# Altium project TrailerController_SuspensionPMS.PrjPcb
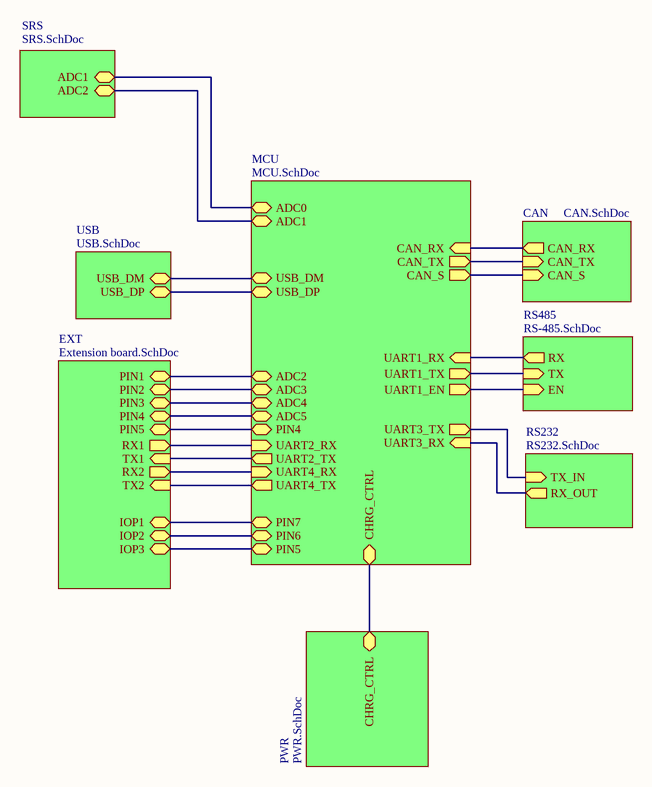
[diagram p0: Main.SchDoc]
9 sheets, 162 parts. Net scope: hierarchical (ports join the sheet entries above them; power ports are global).
Board file: PCB1.PcbDoc
Sheets:
  Main.SchDoc
    SRS = SRS.SchDoc
    MCU = MCU.SchDoc
    CAN = CAN.SchDoc
    PWR = PWR.SchDoc
    USB = USB.SchDoc
    RS485 = RS-485.SchDoc
    RS232 = RS232.SchDoc
    EXT = Extension board.SchDoc

## Sheet Main.SchDoc
size A4

### Sub-sheets
CAN = CAN.SchDoc: CAN_TX (in), CAN_RX (out), CAN_S (in)
EXT = Extension board.SchDoc: PIN1, PIN2, PIN3, PIN4, RX1 (out), TX1 (in), RX2 (out), TX2 (in), IOP1, IOP2, IOP3, PIN5
MCU = MCU.SchDoc: CAN_RX (in), CAN_TX (out), CAN_S (out), USB_DM (bidir), USB_DP (bidir), ADC0, ADC1, ADC2, ADC3, ADC4, ADC5, UART3_TX (out), UART3_RX (in), UART1_RX (in), UART1_TX (out), UART1_EN (out), UART2_RX (in), UART2_TX (out), UART4_RX (in), UART4_TX (out), PIN7, PIN6, CHRG_CTRL, PIN5, PIN4
PWR = PWR.SchDoc: CHRG_CTRL
RS232 = RS232.SchDoc: TX_IN (in), RX_OUT (out)
RS485 = RS-485.SchDoc: RX (out), TX (in), EN (in)
SRS = SRS.SchDoc: ADC1, ADC2
USB = USB.SchDoc: USB_DM (bidir), USB_DP (bidir)

### Nets
ADC0: sheet SRS/ADC1, sheet MCU/ADC0
ADC1: sheet SRS/ADC2, sheet MCU/ADC1
ADC2: sheet MCU/ADC2, sheet EXT/PIN1
ADC3: sheet MCU/ADC3, sheet EXT/PIN2
ADC4: sheet MCU/ADC4, sheet EXT/PIN3
ADC5: sheet MCU/ADC5, sheet EXT/PIN4
CAN_RX: sheet MCU/CAN_RX, sheet CAN/CAN_RX
CAN_S: sheet MCU/CAN_S, sheet CAN/CAN_S
CAN_TX: sheet MCU/CAN_TX, sheet CAN/CAN_TX
CHRG_CTRL: sheet MCU/CHRG_CTRL, sheet PWR/CHRG_CTRL
IOP4: sheet MCU/PIN4, sheet EXT/PIN5
IOP5: sheet MCU/PIN5, sheet EXT/IOP3
IOP6: sheet MCU/PIN6, sheet EXT/IOP2
IOP7: sheet MCU/PIN7, sheet EXT/IOP1
RX: sheet MCU/UART1_RX, sheet RS485/RX
RX1: sheet MCU/UART3_RX, sheet RS232/RX_OUT
TX: sheet MCU/UART1_TX, sheet RS485/TX
TX1: sheet MCU/UART3_TX, sheet RS232/TX_IN
UART1_EN: sheet MCU/UART1_EN, sheet RS485/EN
UART2_RX: sheet MCU/UART2_RX, sheet EXT/RX1
UART2_TX: sheet MCU/UART2_TX, sheet EXT/TX1
UART4_RX: sheet MCU/UART4_RX, sheet EXT/RX2
UART4_TX: sheet MCU/UART4_TX, sheet EXT/TX2
USB_DM: sheet MCU/USB_DM, sheet USB/USB_DM
USB_DP: sheet MCU/USB_DP, sheet USB/USB_DP

## Sheet SRS.SchDoc
size A4
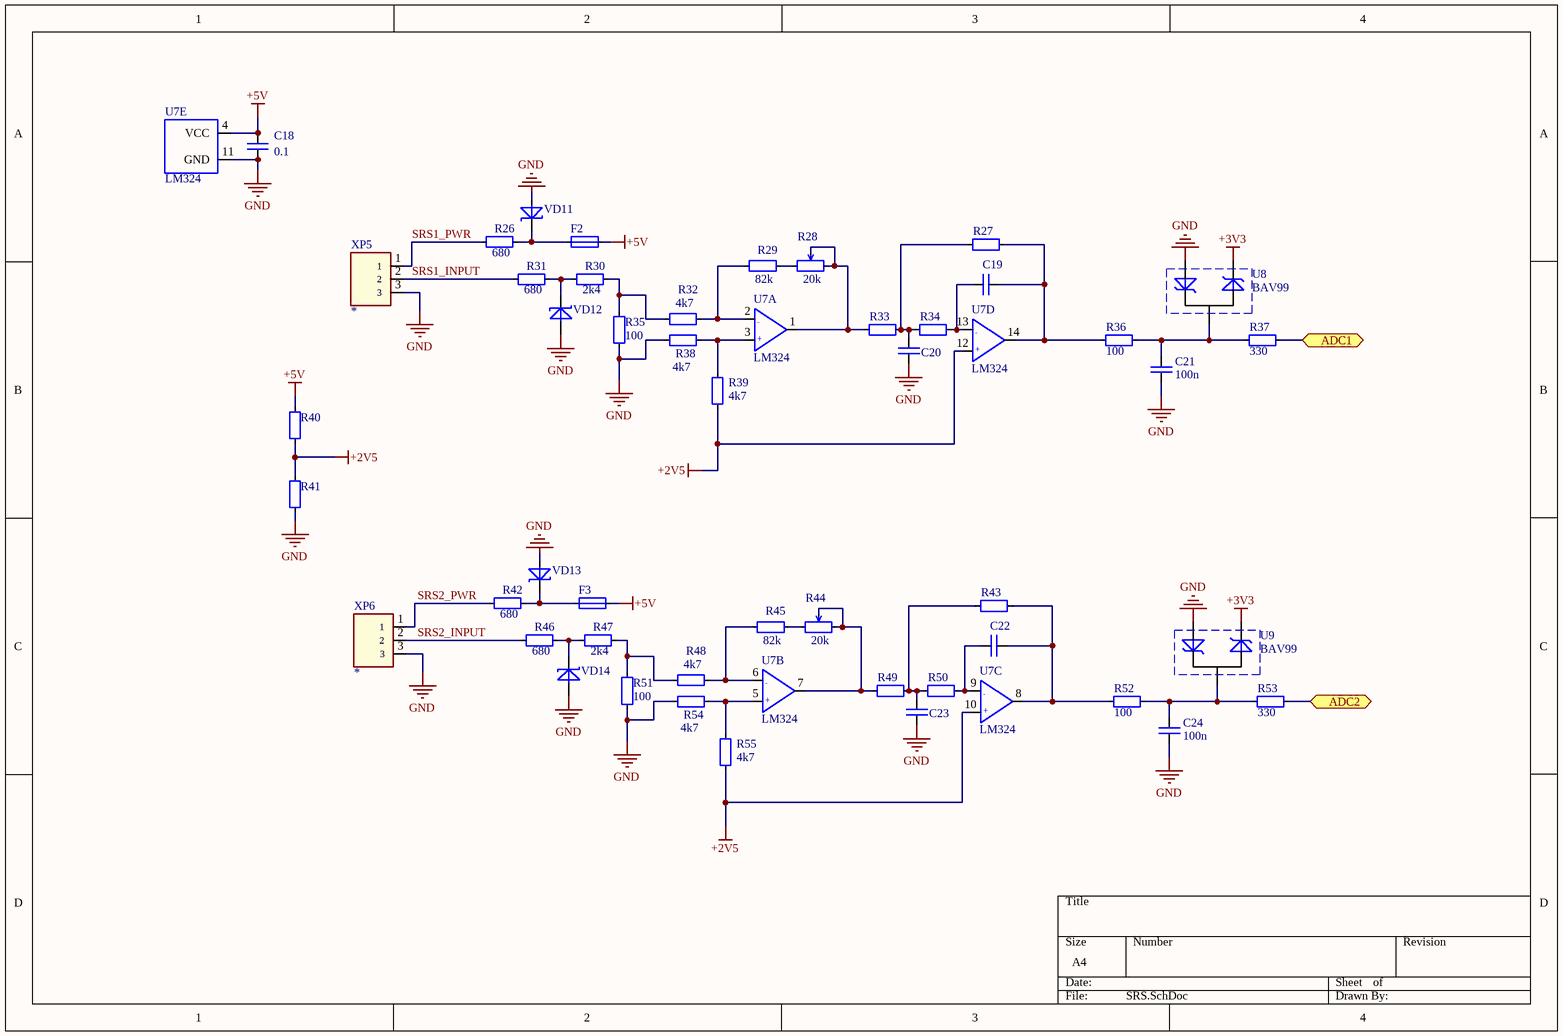
[diagram p1: SRS.SchDoc]

### Parts
C18  0.1  [SMD_0805]
C19  (no value)  [SMD_0805]
C20  (no value)  [SMD_0805]
C21  100n  [SMD_0805]
C22  (no value)  [SMD_0805]
C23  (no value)  [SMD_0805]
C24  100n  [SMD_0805]
F2  (no value)  [SMD_1206]
F3  (no value)  [SMD_1206]
R26  680  [SMD_0805]
R27  (no value)  [SMD_0805]
R28  20k  [RES-ADJ-SMD-Panasonic]
R29  82k  [SMD_0805]
R30  2k4  [SMD_0805]
R31  680  [SMD_0805]
R32  4k7  [SMD_0805]
R33  (no value)  [SMD_0805]
R34  (no value)  [SMD_0805]
R35  100  [SMD_0805]
R36  100  [SMD_0805]
R37  330  [SMD_0805]
R38  4k7  [SMD_0805]
R39  4k7  [SMD_0805]
R40  (no value)  [SMD_0805]
R41  (no value)  [SMD_0805]
R42  680  [SMD_0805]
R43  (no value)  [SMD_0805]
R44  20k  [RES-ADJ-SMD-Panasonic]
R45  82k  [SMD_0805]
R46  680  [SMD_0805]
R47  2k4  [SMD_0805]
R48  4k7  [SMD_0805]
R49  (no value)  [SMD_0805]
R50  (no value)  [SMD_0805]
R51  100  [SMD_0805]
R52  100  [SMD_0805]
R53  330  [SMD_0805]
R54  4k7  [SMD_0805]
R55  4k7  [SMD_0805]
U7  LM324  [SOIC-14]  (parts A,B,C,D,E of 5)
U8  BAV99  [SOT23-3]
U9  BAV99  [SOT23-3]
VD11  (no value)  [DO214-AC]
VD12  (no value)  [DO214-AC]
VD13  (no value)  [DO214-AC]
VD14  (no value)  [DO214-AC]
XP5  *  [MW-3M-2.0]
XP6  *  [MW-3M-2.0]

### Ports
ADC1, ADC2

### Nets
+2V5: R39.2 R40.1 R41.2 R55.2 U7.10(IN3+) U7.12(IN4+)
+3V3: U8.2 U9.2
+5V: C18.2 F2.1 F3.1 R40.2 U7.4(VCC)
GND: C18.1 C20.2 C21.2 C23.2 C24.2 R35.2 R38.1 R41.1 R51.2 R54.1 U7.11(GND) U8.1 U9.1 VD11.2(A) VD12.2(A) VD13.2(A) VD14.2(A) XP5.3 XP6.3
ADC0: R37.2 ; port ADC1
ADC1: R53.2 ; port ADC2
SRS1_INPUT: R31.2 XP5.2
SRS1_PWR: R26.2 XP5.1
SRS2_INPUT: R46.2 XP6.2
SRS2_PWR: R42.2 XP6.1
NetC19_1: C19.1 R34.1 U7.13(IN4-)
NetC19_2: C19.2 R27.1 R36.1 U7.14(OUT4)
NetC20_1: C20.1 R27.2 R33.1 R34.2
NetC21_1: C21.1 R36.2 R37.1 U8.3
NetC22_1: C22.1 R50.1 U7.9(IN3-)
NetC22_2: C22.2 R43.1 R52.1 U7.8(OUT3)
NetC23_1: C23.1 R43.2 R49.1 R50.2
NetC24_1: C24.1 R52.2 R53.1 U9.3
NetF2_2: F2.2 R26.1 VD11.1(C)
NetF3_2: F3.2 R42.1 VD13.1(C)
NetR28_1: R28.1 R29.1
NetR28_2: R28.2 R28.3 R33.2 U7.1(OUT1)
NetR29_2: R29.2 R32.1 U7.2(IN1-)
NetR30_1: R30.1 R32.2 R35.1
NetR30_2: R30.2 R31.1 VD12.1(C)
NetR38_2: R38.2 R39.1 U7.3(IN1+)
NetR44_1: R44.1 R45.1
NetR44_2: R44.2 R44.3 R49.2 U7.7(OUT2)
NetR45_2: R45.2 R48.1 U7.6(IN2-)
NetR46_1: R46.1 R47.2 VD14.1(C)
NetR47_1: R47.1 R48.2 R51.1
NetR54_2: R54.2 R55.1 U7.5(IN2+)

### Notes on the sheet
- (in symbol LM324, part A) -; +
- (in symbol LM324, part B) -; +
- (in symbol LM324, part C) -; +
- (in symbol LM324, part D) -; +

### Library data of the parts
C18-C24 = C_NONE_POLAR: None polar capacitor; Case: *
  C18: Value: 0.1
  C21 C24: Value: 100n
F2 F3 = FUSE: Resistor; Case: 1206
R26 R27 R29-R43 R45-R55 = RES: Resistor; Case: *
  R26 R31 R42 R46: Value: 680
  R29 R45: Value: 82k
  R30 R47: Value: 2k4
  R32 R38 R39 R48 R54 R55: Value: 4k7
  R35 R36 R51 R52: Value: 100
  R37 R53: Value: 330
R28 R44 = RES_ADJ: Agjustable resistor; Value: 20k
U7 = LM324: OpAmp
U8 U9 = BAV99: TVS diodes
VD11-VD14 = ZENER: Zener diode
XP5 XP6 = CON_3

## Sheet MCU.SchDoc
size A4
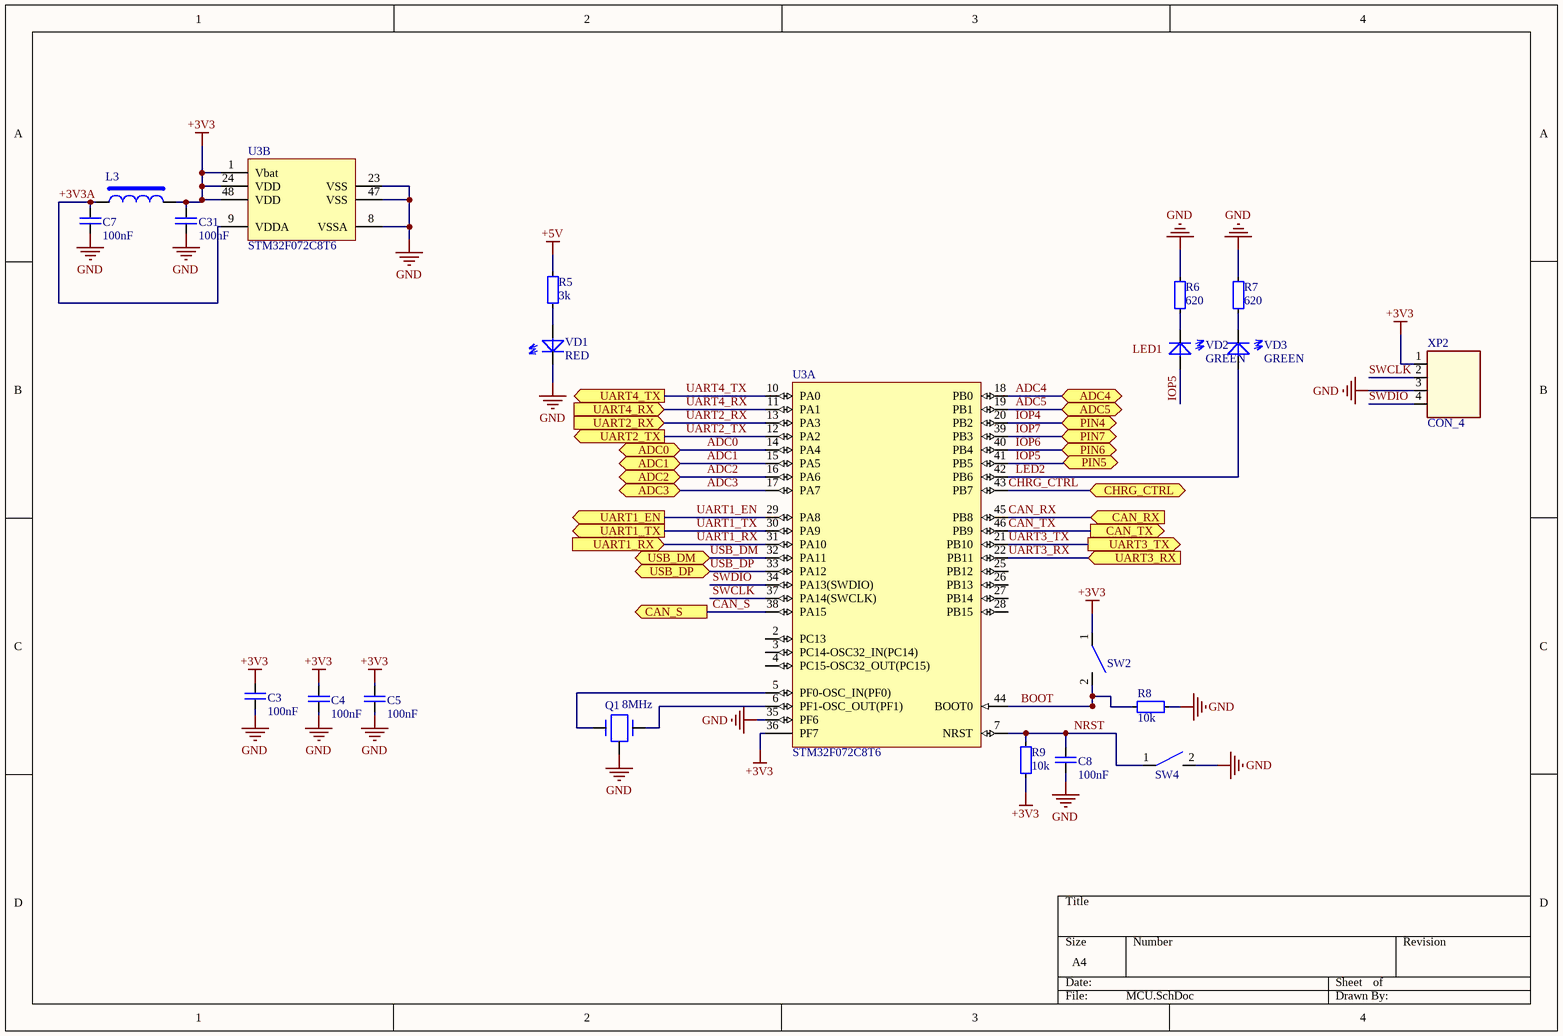
[diagram p2: MCU.SchDoc]

### Parts
C3  100nF  [SMD_0805]
C4  100nF  [SMD_0805]
C5  100nF  [SMD_0805]
C7  100nF  [SMD_0805]
C8  100nF  [SMD_0805]
C31  100nF  [SMD_0805]
L3  (no value)  [INDC4516AM]
Q1  8MHz  [CSTCC-CRYSTAL]
R5  3k  [SMD_0805]
R6  620  [SMD_0805]
R7  620  [SMD_0805]
R8  10k  [SMD_0805]
R9  10k  [SMD_0805]
SW2  SW  [SW_6/3.7]  (value not drawn)
SW4  SW  [SW_6/3.7]  (value not drawn)
U3  STM32F072C8T6  [STM-LQFP48_L]  (parts A,B of 2)
VD1  RED  [SMD_0805]
VD2  GREEN  [SMD_0805]
VD3  GREEN  [SMD_0805]
XP2  CON_4  [HEAD-1/4/2.54]

### Ports
ADC0, ADC1, ADC2, ADC3, ADC4, ADC5, CAN_RX (in), CAN_S (out), CAN_TX (out), CHRG_CTRL, PIN4, PIN5, PIN6, PIN7, UART1_EN (out), UART1_RX (in), UART1_TX (out), UART2_RX (in), UART2_TX (out), UART3_RX (in), UART3_TX (out), UART4_RX (in), UART4_TX (out), USB_DM (bidir), USB_DP (bidir)

### Nets
+3V3: C3.1 C4.1 C5.1 C31.1 L3.2 R9.2 SW2.1 U3.1(Vbat) U3.24(VDD) U3.36(PF7) U3.48(VDD) XP2.1
+5V: R5.1
GND: C3.2 C4.2 C5.2 C7.2 C8.2 C31.2 Q1.2 R6.1 R7.1 R8.1 SW4.2 U3.8(VSSA) U3.23(VSS) U3.35(PF6) U3.47(VSS) VD1.1(C) XP2.3
+3V3A: C7.1 L3.1 U3.9(VDDA)
ADC0: U3.14(PA4) ; port ADC0
ADC1: U3.15(PA5) ; port ADC1
ADC2: U3.16(PA6) ; port ADC2
ADC3: U3.17(PA7) ; port ADC3
ADC4: U3.18(PB0) ; port ADC4
ADC5: U3.19(PB1) ; port ADC5
BOOT: R8.2 SW2.2 U3.44(BOOT0)
CAN_RX: U3.45(PB8) ; port CAN_RX
CAN_S: U3.38(PA15) ; port CAN_S
CAN_TX: U3.46(PB9) ; port CAN_TX
CHRG_CTRL: U3.43(PB7) ; port CHRG_CTRL
IOP4: U3.20(PB2) ; port PIN4
IOP5: U3.41(PB5) VD2.2(A) ; port PIN5
IOP6: U3.40(PB4) ; port PIN6
IOP7: U3.39(PB3) ; port PIN7
LED2: U3.42(PB6) VD3.2(A)
NRST: C8.1 R9.1 SW4.1 U3.7(NRST)
SWCLK: U3.37(PA14(SWCLK)) XP2.2
SWDIO: U3.34(PA13(SWDIO)) XP2.4
UART1_EN: U3.29(PA8) ; port UART1_EN
UART1_RX: U3.31(PA10) ; port UART1_RX  [project net RX]
UART1_TX: U3.30(PA9) ; port UART1_TX  [project net TX]
UART2_RX: U3.13(PA3) ; port UART2_RX
UART2_TX: U3.12(PA2) ; port UART2_TX
UART3_RX: U3.22(PB11) ; port UART3_RX  [project net RX1]
UART3_TX: U3.21(PB10) ; port UART3_TX  [project net TX1]
UART4_RX: U3.11(PA1) ; port UART4_RX
UART4_TX: U3.10(PA0) ; port UART4_TX
USB_DM: U3.32(PA11) ; port USB_DM
USB_DP: U3.33(PA12) ; port USB_DP
NetQ1_1: Q1.1 U3.5(PF0-OSC_IN(PF0))
NetQ1_3: Q1.3 U3.6(PF1-OSC_OUT(PF1))
NetR5_2: R5.2 VD1.2(A)
NetR6_2: R6.2 VD2.1(C)
NetR7_2: R7.2 VD3.1(C)

Not connected (* = marked no-connect by the designer): SW2 3 4; SW4 3 4; U3 2(PC13) 3(PC14-OSC32_IN(PC14)) 4(PC15-OSC32_OUT(PC15)) 25(PB12) 26(PB13) 27(PB14) 28(PB15)

### Notes on the sheet
- Labels drawn without touching a wire or pin: LED1

### Library data of the parts
C3-C5 C7 C8 C31 = C_NONE_POLAR: None polar capacitor; Value: 100nF
  C7 C31: Case: 0805
L3 = FB: Ferrite Bread
Q1 = CRYSTAL_CAP: Crystal oscillator; Model: CSTCC8M00G53A-R0; Value: 8MHz
R5-R9 = RES: Resistor
  R5: Value: 3k
  R6 R7: Value: 620
  R8 R9: Value: 10k
SW2 SW4 = SW: Switch
U3 = STM32F072C8T6: ARM Cortex-M0 32-bit MCU, 64 KB Flash, 8 KB Internal RAM, 39 I/Os, 48-pin LQFP, -40 to 85 degC, Tray; PartNumber: STM32F030C8T6; FLASH Size (Prog) (kB): 64; I/Os (High Current): 39; Internal RAM Size (kB): 8; Operating Frequency(F) (Processor speed) (MHz): 48; Supply Voltage(Vcc) min (V): 2.4; DatasheetVersion: Rev. 1; PackageVersion: Rev. 6, 06/2013; PackageReference: LQFP48; PackageDescription: 48-Pin Low Profile Quad Flat Package, 7 x 7 mm Body, 0.5 mm Pitch; Supplier 1: Digi-Key; Supplier Part Number 1: 497-14043-ND; Supplier 2: Newark; Supplier Part Number 2: 06X3647; Supplier 3: Mouser; Supplier Part Number 3: 511-STM32F030C8T6; Core: ARM Cortex-M0; Packing: Tray; Mounting Technology: Surface Mount; ComponentLink1Description: Manufacturer URL; ComponentLink1URL: http://www.st.com/web/en/home.html; ComponentLink2Description: Datasheet; ComponentLink2URL: http://www.st.com/st-web-ui/static/active/en/resource/technical/document/datasheet/DM00088500.pdf; ComponentLink3Description: Package Specification; ComponentLink3URL: http://www.st.com/st-web-ui/static/active/en/resource/technical/document/datasheet/DM00058181.pdf
VD1-VD3 = LED: Value: 0805

## Sheet CAN.SchDoc
size A4
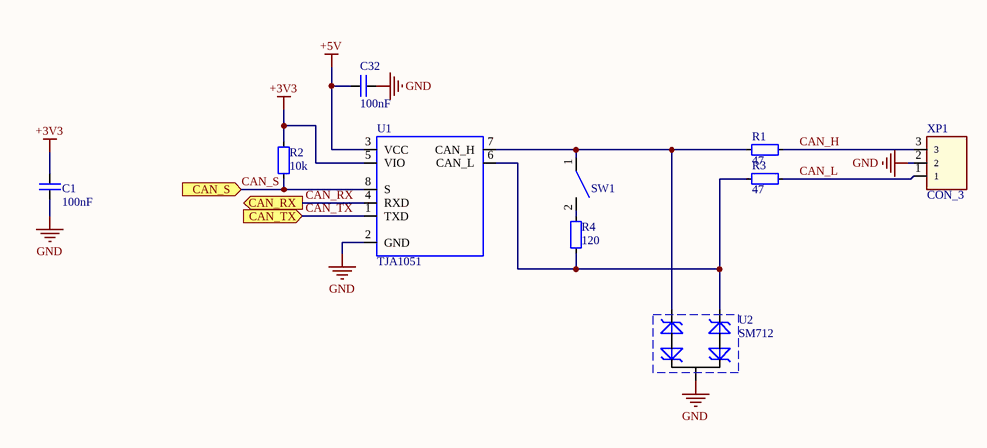
[diagram p3: CAN.SchDoc]

### Parts
C1  100nF  [SMD_0805]
C32  100nF  [SMD_0805]
R1  47  [SMD_0805]
R2  10k  [SMD_0805]
R3  47  [SMD_0805]
R4  120  [SMD_0805]
SW1  SW_DIP/2.54  [DIP-SW/2.54/1]  (value not drawn)
U1  TJA1051  [SO8-150mil]
U2  SM712  [SOT23-3]
XP1  CON_3  [MW-3M-2.0]

### Ports
CAN_RX (out), CAN_S (in), CAN_TX (in)

### Nets
+3V3: C1.1 R2.2 U1.5(VIO)
+5V: C32.1 U1.3(VCC)
GND: C1.2 C32.2 U1.2(GND) U2.3 XP1.2
CAN_H: R1.1 XP1.3
CAN_L: R3.1 XP1.1
CAN_RX: U1.4(RXD) ; port CAN_RX
CAN_S: R2.1 U1.8(S) ; port CAN_S
CAN_TX: U1.1(TXD) ; port CAN_TX
NetR1_2: R1.2 SW1.1 U1.7(CAN_H) U2.1
NetR3_2: R3.2 R4.1 U1.6(CAN_L) U2.2
NetR4_2: R4.2 SW1.2

Not connected (* = marked no-connect by the designer): SW1 3 4

### Library data of the parts
C1 C32 = C_NONE_POLAR: None polar capacitor; Value: 100nF
  C32: Case: 0805
R1-R4 = RES: Resistor
  R1 R3: Value: 47; Case: 0805
  R2: Value: 10k
  R4: Value: 120
SW1 = SW: Switch
U2 = SM712: TVS diodes

## Sheet PWR.SchDoc
size A4
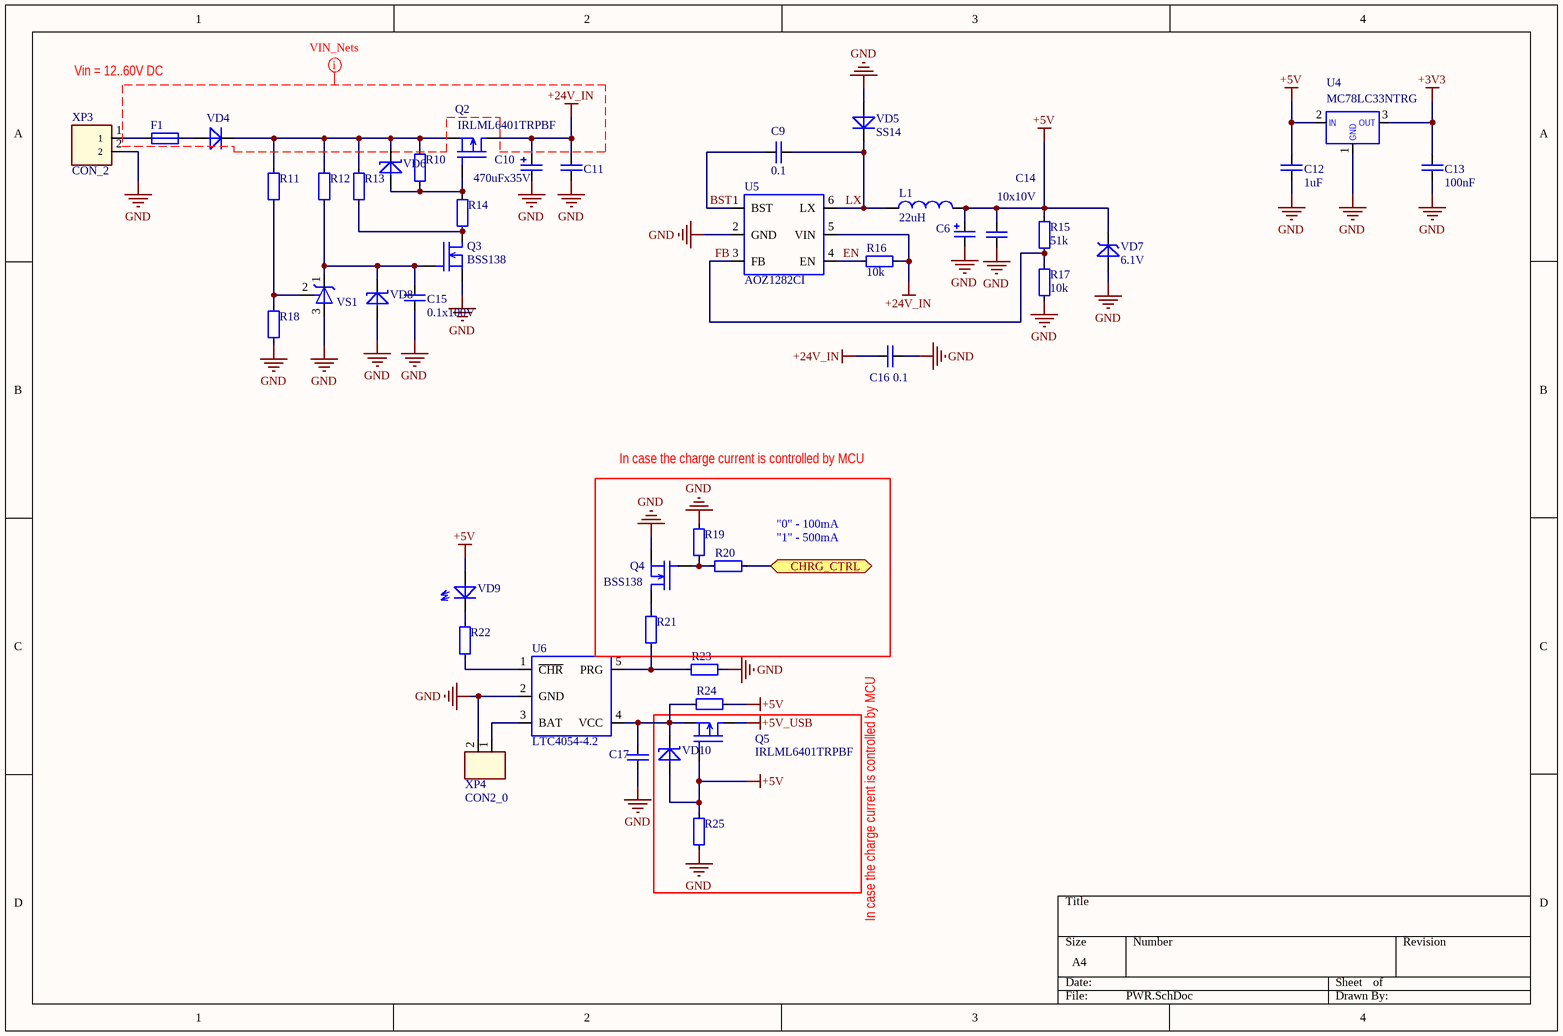
[diagram p4: PWR.SchDoc]

### Parts
C6  (no value)  [SMD_Tantalum_CAP-D]
C9  0.1  [SMD_0805]
C10  470uFx35V  [CAPR-10/5]
C11  (no value)  [SMD_0805]
C12  1uF  [SMD_0805]
C13  100nF  [SMD_0805]
C14  10x10V  [SMD_0805]
C15  0.1x100V  [SMD_0805]
C16  0.1  [SMD_0805]
C17  (no value)  [SMD_0805]
F1  (no value)  [SMD_1206]
L1  22uH  [IND-1812]
Q2  IRLML6401TRPBF  [SOT23-3PIN]
Q3  BSS138  [SOT23-3PIN]
Q4  BSS138  [SOT23-3PIN]
Q5  IRLML6401TRPBF  [SOT23-3PIN]
R10  (no value)  [SMD_0805]
R11  (no value)  [SMD_0805]
R12  (no value)  [SMD_0805]
R13  (no value)  [SMD_0805]
R14  (no value)  [SMD_0805]
R15  51k  [SMD_0805]
R16  10k  [SMD_0805]
R17  10k  [SMD_0805]
R18  (no value)  [SMD_0805]
R19  (no value)  [SMD_0805]
R20  (no value)  [SMD_0805]
R21  (no value)  [SMD_0805]
R22  (no value)  [SMD_0805]
R23  (no value)  [SMD_0805]
R24  (no value)  [SMD_0805]
R25  (no value)  [SMD_0805]
U4  MC78LC33NTRG  [SOT753]
U5  AOZ1282CI  [SOT-23-6]
U6  LTC4054-4.2  [SOT753]
VD4  (no value)  [DO214-AC]
VD5  SS14  [DO214-AC]
VD6  (no value)  [SOD-123]
VD7  6.1V  [DO214-AC]
VD8  (no value)  [SOD-123]
VD9  (no value)  [SMD_0805]
VD10  (no value)  [SOD-123]
VS1  TL431  [SOT23-3]  (value not drawn)
XP3  CON_2  [DG142V-5.08-2]
XP4  CON2_0  [MW-2M-2.0]

### Blocks framed on the sheet
In case the charge current is controlled by MCU: Q4 R19-R21

### Ports
CHRG_CTRL

### Nets
+3V3: C13.1 U4.3(OUT)
+5V: C6.1 C12.1 C14.1 L1.2 Q5.1(G) R15.2 R24.1 R25.1 U4.2(IN) VD7.1 VD9.2(A) VD10.2(A)
+5V_USB: Q5.3(D)
+24V_IN: C10.1 C11.1 C16.1 Q2.3(D) R16.1 U5.5(VIN)
GND: C6.2 C10.2 C11.2 C12.2 C13.2 C14.2 C15.2 C16.2 C17.2 Q3.2(S) Q4.2(S) R17.1 R18.1 R19.2 R23.1 R25.2 U4.1(GND) U5.2(GND) U6.2(GND) VD5.2(A) VD7.2 VD8.2(A) VS1.3 XP3.2 XP4.2
BST: C9.1 U5.1(BST)
CHRG_CTRL: R20.2 ; port CHRG_CTRL
EN: R16.2 U5.4(EN)
FB: R15.1 R17.2 U5.3(FB)
LX: C9.2 L1.1 U5.6(LX) VD5.1(C)
NetC15_1: C15.1 Q3.1(G) R12.1 VD8.1(C) VS1.1
NetC17_1: C17.1 Q5.2(S) R24.2 U6.4(VCC) VD10.1(C)
NetF1_1: F1.1 VD4.2(A)
NetF1_2: F1.2 XP3.1
NetQ2_1: Q2.1(G) R10.1 R14.2 VD6.2(A)
NetQ2_2: Q2.2(S) R10.2 R11.2 R12.2 R13.2 VD4.1(C) VD6.1(C)
NetQ3_3: Q3.3(D) R13.1 R14.1
NetQ4_1: Q4.1(G) R19.1 R20.1
NetQ4_3: Q4.3(D) R21.1
NetR11_1: R11.1 R18.2 VS1.2
NetR21_2: R21.2 R23.2 U6.5(PRG)
NetR22_1: R22.1 VD9.1(C)
NetR22_2: R22.2 U6.1(~{CHR})
NetU6_3: U6.3(BAT) XP4.1

### Layout directives
net class VIN_NETS: +24V_IN

### Notes on the sheet
- Vin = 12..60V DC
- (near R20) "0" - 100mA
  "1" - 500mA
- In case the charge current is controlled by MCU

### Library data of the parts
C6 C10 = C_POLAR: Polar capacitor
  C10: Value: 470uFx35V
C9 C11 C12 C14-C17 = C_NONE_POLAR: None polar capacitor
  C9 C16: Value: 0.1; Case: *
  C11 C17: Case: *
  C12: Value: 1uF
  C14: Value: 10x10V; Case: *
  C15: Value: 0.1x100V; Case: *
C13 = C_NONE_POLAR: None polar capacitor; Value: 100n
F1 = FUSE: Resistor
L1 = INDUCTOR: Value: 22uH
Q2 Q5 = IRLML6401TRPBF: P-Channel; Manufacture: IR; Rds: 0.05Ohm; Vds: 12V; Ids: 3.4A; Model: IRLML6401TRPBF; HelpURL: http://www.kosmodrom.com.ua/pdf/IRLML6401TRPBF.pdf; Case: SOT-23-6
Q3 Q4 = BSS138: IG-FET N-Channel; Manufacture: Fairchild; Model: BSS138; HelpURL: https://cdn.sparkfun.com/datasheets/BreakoutBoards/BSS138.pdf; Case: SOT-23
R10-R25 = RES: Resistor; Case: *
  R15: Value: 51k
  R16 R17: Value: 10k
U4 = MC78LC33NTRG: Low dropout Linear Voltage Regulator
U5 = AOZ1282CI: Buck regulator; Help: *; Value: AOZ1282CI
U6 = LTC4054-4.2: Buck regulator; Help: *; Value: LTC4054-4.2
VD4 VD5 = DIODE: Case: *
  VD5: Value: SS14
VD6 VD8 VD10 = ZENER: Zener diode
VD7 = DIOSE_TVS: TVS Diode; Value: 6.1V
VD9 = LED
XP3 = CON_2: Value: DG142V-5.08-02P-14-00AH

## Sheet USB.SchDoc
size A4
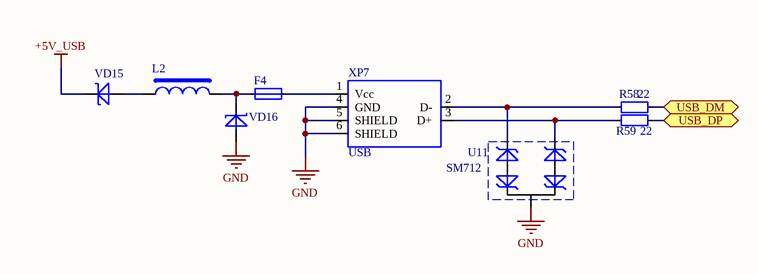
[diagram p5: USB.SchDoc]

### Parts
F4  (no value)  [SMD_1206]
L2  (no value)  [INDC4516AM]
R58  22  [SMD_0805]
R59  22  [SMD_0805]
U11  SM712  [SOT23-3]
VD15  (no value)  [SOD-123]
VD16  (no value)  [SOD-123]
XP7  USB  [USB/SM0.8-6H5]

### Ports
USB_DM (bidir), USB_DP (bidir)

### Nets
+5V_USB: VD15.1(C)
GND: U11.3 VD16.2(A) XP7.4(GND) XP7.5(SHIELD) XP7.6(SHIELD)
USB_DM: R58.1 ; port USB_DM
USB_DP: R59.1 ; port USB_DP
NetF4_1: F4.1 XP7.1(Vcc)
NetF4_2: F4.2 L2.2 VD16.1(C)
NetL2_1: L2.1 VD15.2(A)
NetR58_2: R58.2 U11.1 XP7.2(D-)
NetR59_2: R59.2 U11.2 XP7.3(D+)

### Library data of the parts
F4 = FUSE: Resistor; Case: 1206
L2 = FB: Ferrite Bread; Case: INDC4516AM
R58 R59 = RES: Resistor; Value: 22; Case: *
U11 = SM712: TVS diodes
VD15 VD16 = ZENER: Zener diode; Case: SOD-123

## Sheet RS-485.SchDoc
size A4
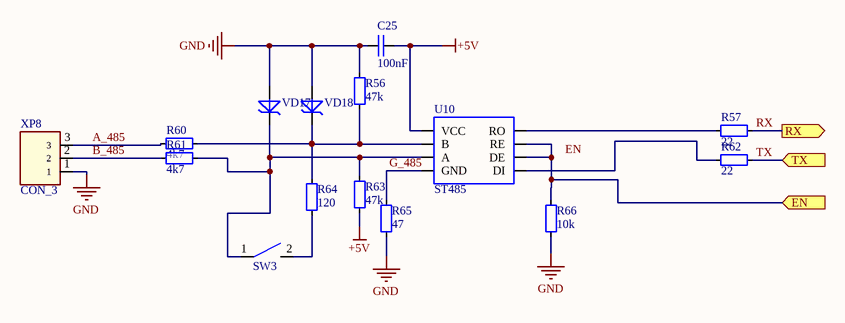
[diagram p6: RS-485.SchDoc]

### Parts
C25  100nF  [SMD_0805]
R56  47k  [SMD_0805]
R57  22  [SMD_0805]
R60  4k7  [SMD_0805]
R61  4k7  [SMD_0805]
R62  22  [SMD_0805]
R63  47k  [SMD_0805]
R64  120  [SMD_0805]
R65  47  [SMD_0805]
R66  10k  [SMD_0805]
SW3  SW_DIP/2.54  [DIP-SW/2.54/1]  (value not drawn)
U10  ST485  [SO8-150mil]
VD17  (no value)  [DO214-AC]
VD18  (no value)  [DO214-AC]
XP8  CON_3  [MW-3M-2.0]

### Ports
EN (in), RX (out), TX (in)

### Nets
+5V: C25.2 R63.1 U10.8(VCC)
GND: C25.1 R56.2 R65.1 R66.1 VD17.2 VD18.2 XP8.1
A_485: R60.2 XP8.3
B_485: R61.2 XP8.2
G_485: R65.2 U10.5(GND)
RX: R57.1 ; port RX
TX: R62.1 ; port TX
UART1_EN: R66.2 U10.2(RE) U10.3(DE) ; port EN
NetR56_1: R56.1 R60.1 R64.2 U10.7(B) VD18.1
NetR57_2: R57.2 U10.1(RO)
NetR61_1: R61.1 R63.2 SW3.1 U10.6(A) VD17.1
NetR62_2: R62.2 U10.4(DI)
NetR64_1: R64.1 SW3.2

Not connected (* = marked no-connect by the designer): SW3 3 4

### Notes on the sheet
- Labels drawn without touching a wire or pin: EN

### Library data of the parts
C25 = C_NONE_POLAR: None polar capacitor; Value: 100nF; Case: 0805
R56 R57 R60-R66 = RES: Resistor; Case: 0805
  R56 R63: Value: 47k
  R57 R62: Value: 22
  R60 R61: Value: 4k7
  R64: Value: 120
  R65: Value: 47
  R66: Value: 10k
SW3 = SW: Switch
U10 = ST485: RS485 interface
VD17 VD18 = DIOSE_TVS: TVS Diode

## Sheet RS232.SchDoc
size A4
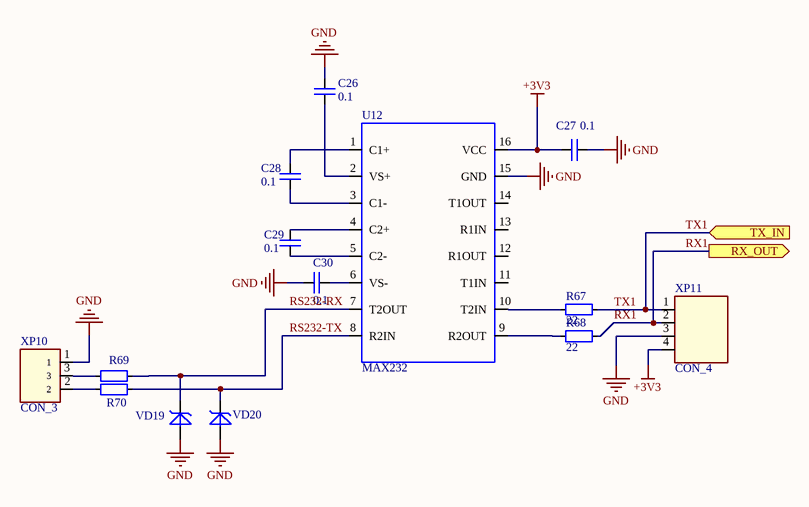
[diagram p7: RS232.SchDoc]

### Parts
C26  0.1  [SMD_0805]
C27  0.1  [SMD_0805]
C28  0.1  [SMD_0805]
C29  0.1  [SMD_0805]
C30  0.1  [SMD_0805]
R67  22  [SMD_0805]
R68  22  [SMD_0805]
R69  (no value)  [SMD_0805]
R70  (no value)  [SMD_0805]
U12  MAX232  [SOIC-16]
VD19  (no value)  [DO214-AC]
VD20  (no value)  [DO214-AC]
XP10  CON_3  [MW-3M-2.0]
XP11  CON_4  [HEAD-1/4/2.54]

### Ports
RX_OUT (out), TX_IN (in)

### Nets
+3V3: C27.1 U12.16(VCC) XP11.4
GND: C26.2 C27.2 C30.2 U12.15(GND) VD19.2 VD20.2 XP10.1 XP11.3
RS232-RX: R69.1 U12.7(T2OUT) VD19.1
RS232-TX: R70.1 U12.8(R2IN) VD20.1
RX1: R68.1 XP11.2 ; port RX_OUT
TX1: R67.1 XP11.1 ; port TX_IN
NetC26_1: C26.1 U12.2(VS+)
NetC28_1: C28.1 U12.1(C1+)
NetC28_2: C28.2 U12.3(C1-)
NetC29_1: C29.1 U12.4(C2+)
NetC29_2: C29.2 U12.5(C2-)
NetC30_1: C30.1 U12.6(VS-)
NetR67_2: R67.2 U12.10(T2IN)
NetR68_2: R68.2 U12.9(R2OUT)
NetR69_2: R69.2 XP10.3
NetR70_2: R70.2 XP10.2

Not connected (* = marked no-connect by the designer): U12 11(T1IN) 12(R1OUT) 13(R1IN) 14(T1OUT)

### Library data of the parts
C26-C30 = C_NONE_POLAR: None polar capacitor; Value: 0.1; Case: *
R67-R70 = RES: Resistor
  R67 R68: Value: 22; Case: 0805
  R69 R70: Case: *
U12 = MAX232: RS232 transceiver
VD19 VD20 = DIOSE_TVS: TVS Diode

## Sheet Extension board.SchDoc
size A4
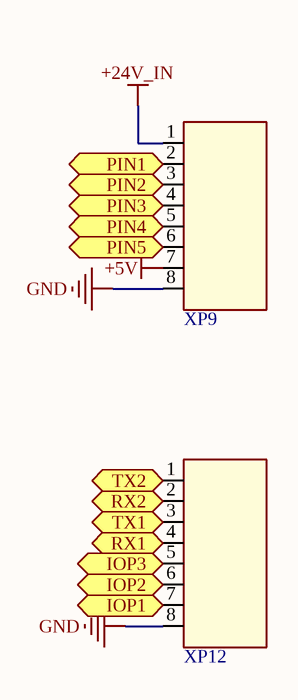
[diagram p8: Extension board.SchDoc]

### Parts
XP9  CON_8  [HEAD-1/8/2.54]  (value not drawn)
XP12  CON_8  [HEAD-1/8/2.54]  (value not drawn)

### Ports
IOP1, IOP2, IOP3, PIN1, PIN2, PIN3, PIN4, PIN5, RX1 (out), RX2 (out), TX1 (in), TX2 (in)

### Nets
+5V: XP9.7
+24V_IN: XP9.1
GND: XP9.8 XP12.8
ADC2: XP9.2 ; port PIN1
ADC3: XP9.3 ; port PIN2
ADC4: XP9.4 ; port PIN3
ADC5: XP9.5 ; port PIN4
IOP4: XP9.6 ; port PIN5
IOP5: XP12.5 ; port IOP3
IOP6: XP12.6 ; port IOP2
IOP7: XP12.7 ; port IOP1
UART2_RX: XP12.4 ; port RX1
UART2_TX: XP12.3 ; port TX1
UART4_RX: XP12.2 ; port RX2
UART4_TX: XP12.1 ; port TX2

## Nets that join several sheets
+3V3: SRS (U8.2 U9.2), MCU (12 pins), CAN (C1.1 R2.2 U1.5), PWR (C13.1 U4.3), RS232 (C27.1 U12.16 XP11.4)
+5V: SRS (5 pins), MCU (R5.1), CAN (C32.1 U1.3), PWR (12 pins), RS-485 (C25.2 R63.1 U10.8), Extension board (XP9.7)
+5V_USB: PWR (Q5.3), USB (VD15.1)
+24V_IN: PWR (6 pins), Extension board (XP9.1)
GND: SRS (19 pins), MCU (17 pins), CAN (5 pins), PWR (25 pins), USB (5 pins), RS-485 (7 pins), RS232 (8 pins), Extension board (XP9.8 XP12.8)
ADC0: SRS (R37.2), MCU (U3.14)
ADC1: SRS (R53.2), MCU (U3.15)
ADC2: MCU (U3.16), Extension board (XP9.2)
ADC3: MCU (U3.17), Extension board (XP9.3)
ADC4: MCU (U3.18), Extension board (XP9.4)
ADC5: MCU (U3.19), Extension board (XP9.5)
CAN_RX: MCU (U3.45), CAN (U1.4)
CAN_S: MCU (U3.38), CAN (R2.1 U1.8)
CAN_TX: MCU (U3.46), CAN (U1.1)
CHRG_CTRL: MCU (U3.43), PWR (R20.2)
IOP4: MCU (U3.20), Extension board (XP9.6)
IOP5: MCU (U3.41 VD2.2), Extension board (XP12.5)
IOP6: MCU (U3.40), Extension board (XP12.6)
IOP7: MCU (U3.39), Extension board (XP12.7)
RX: MCU (U3.31), RS-485 (R57.1)
RX1: MCU (U3.22), RS232 (R68.1 XP11.2)
TX: MCU (U3.30), RS-485 (R62.1)
TX1: MCU (U3.21), RS232 (R67.1 XP11.1)
UART1_EN: MCU (U3.29), RS-485 (R66.2 U10.2 U10.3)
UART2_RX: MCU (U3.13), Extension board (XP12.4)
UART2_TX: MCU (U3.12), Extension board (XP12.3)
UART4_RX: MCU (U3.11), Extension board (XP12.2)
UART4_TX: MCU (U3.10), Extension board (XP12.1)
USB_DM: MCU (U3.32), USB (R58.1)
USB_DP: MCU (U3.33), USB (R59.1)